# EasyEDA Pro project ProDoc_v03_02_PROTOCOL_ANALYZER_DUINO_4Plane_2025-05-19.epro

# Board v03_02_PROTOCOL_ANALYZER_DUINO_4Plane
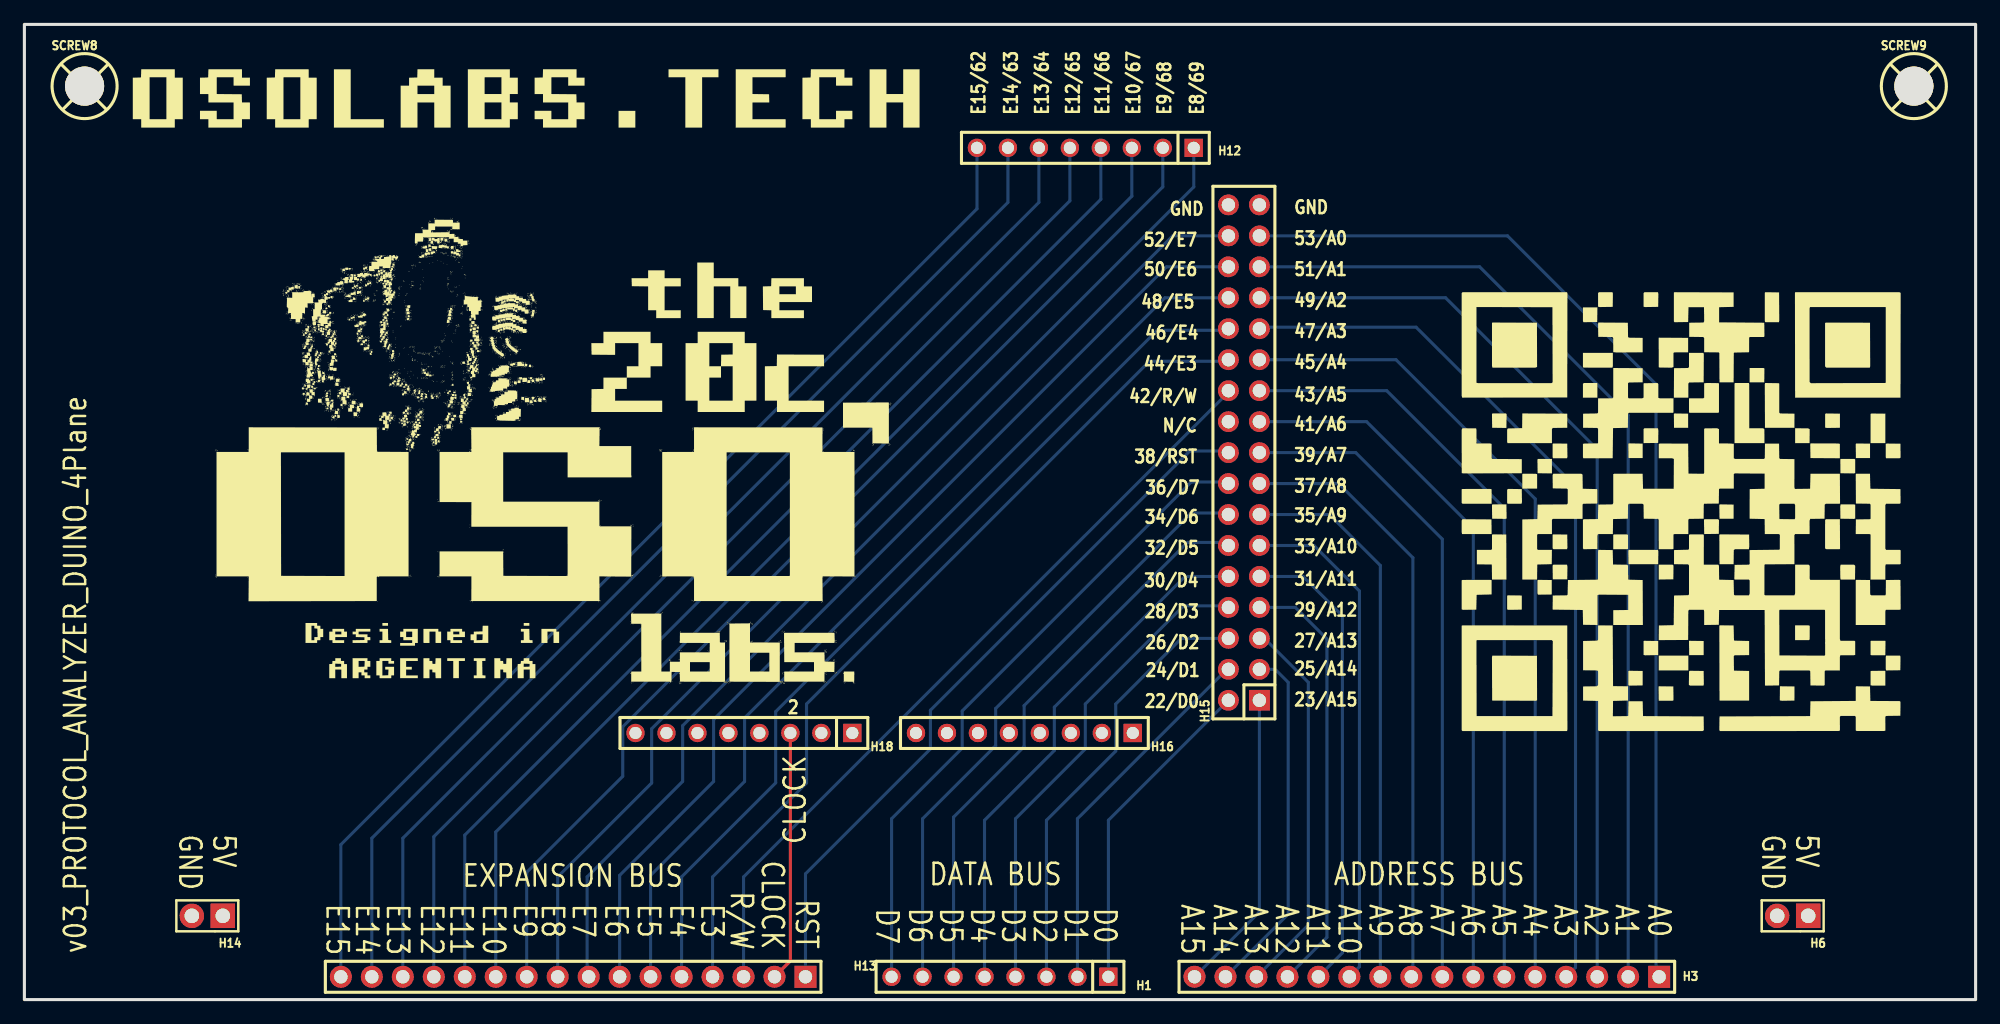
[diagram p0: board, top side]
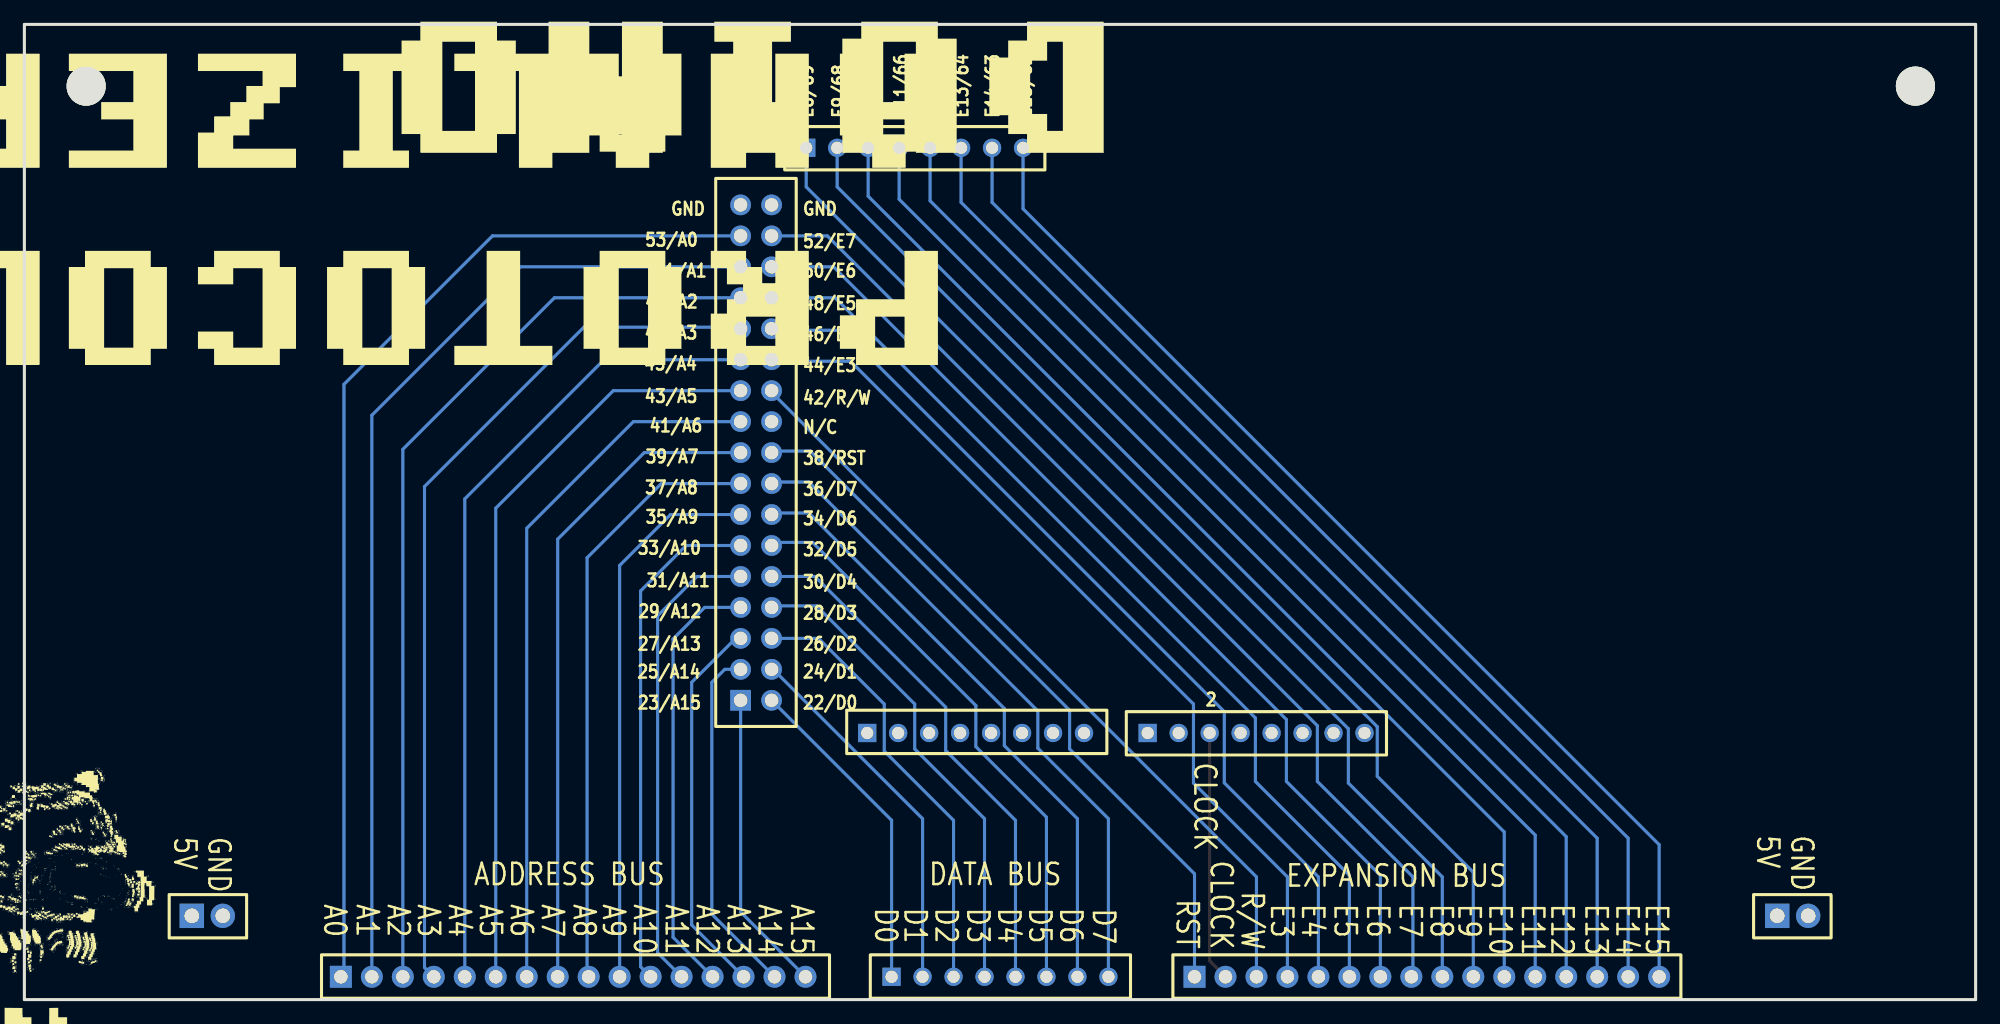
[diagram p1: board, bottom side, seen from below]

Outline 160 x 80 mm; copper layers: Top Layer, GROUND, 5V, Bottom Layer. Coordinates in mm from the lower left corner of the outline.
Outline path: rectangle 0,80 160,0
Stack: Top Layer 0.035mm 外层铜厚1oz / Dielectric1 0.2104mm 7628 RC49% 8.6mil / GROUND 0.0152mm 内层铜厚 / Dielectric2 1.065mm 1.1mm H/HOZ 含铜 / 5V 0.0152mm 内层铜厚 / Dielectric3 0.2104mm 7628 RC49% 8.6mil / Bottom Layer 0.035mm 外层铜厚1oz

## Design rules (mm)
template: Custom Config
spacing copperThickness1oz (default): track to track 0.102, other pairs 0.152 to 0.3
spacing copperThickness2oz: track to track 0.203, other pairs 0.152 to 0.3
track width copperThickness1oz (default): min 0.127, default 0.254, max 2.54
track width copperThickness2oz: min 0.203, default 0.254, max 2.54
differential pair differentialPair (default): width min 0.127, default 0.254, max 2.54; gap min 0.152, default 0.152
via viaSize (default): diameter min 0.5, default 0.61, max 10; hole min 0.3, default 0.305, max 6.299
net 5V uses 5VPlane

## Placement (name value [footprint] x y rotation side)
H1  X6511WV-08H-C60D30  [HDR-TH_8P-P2.54-V-M]  80 1.87 180 top
H3  X6511WV-16H-C60D30  [HDR-TH_16P-P2.54-V-M]  115 1.87 180 top
H6  X6511WV-02H-C60D30  [HDR-TH_2P-P2.54-V-M]  145 6.87 180 top
H12  X6511WV-08H-C60D30  [HDR-TH_8P-P2.54-V-M]  87 69.87 180 top
H13  X6511WV-16H-C60D30  [HDR-TH_16P-P2.54-V-M]  45 1.87 180 top
H14  X6511WV-02H-C60D30  [HDR-TH_2P-P2.54-V-M]  15 6.87 180 top
H15  PZ254-2-17-Z-8.5  [HDR-TH_34P-P2.54-V-M-R2-C17-S2.54]  100 44.87 90 top
H16  X6511WV-08H-C60D30  [HDR-TH_8P-P2.54-V-M]  82 21.87 180 top
H18  X6511WV-08H-C60D30  [HDR-TH_8P-P2.54-V-M]  59 21.87 180 top
SCREW8  -  [Screw-Hole-M3]  5 74.87 0 top
SCREW9  -  [Screw-Hole-M3]  155 74.87 0 top

## Footprints (pads in the part's own frame, mm; a bottom-side part is the same pattern mirrored in y, then rotated)
HDR-TH_2P-P2.54-V-M
  rect 2x2 hole 1.2: 1(-1.27,0)
  round 2 hole 1.2: 2(1.27,0)
HDR-TH_8P-P2.54-V-M
  rect 1.5x1.5 hole 1: 1(-8.89,0)
  round 1.5 hole 1: 2(-6.35,0) 3(-3.81,0) 4(-1.27,0) 5(1.27,0) 6(3.81,0) 7(6.35,0) 8(8.89,0)
HDR-TH_16P-P2.54-V-M
  rect 1.8x1.8 hole 1.1: 1(-19.05,0)
  round 1.8 hole 1.1: 2(-16.51,0) 3(-13.97,0) 4(-11.43,0) 5(-8.89,0) 6(-6.35,0) 7(-3.81,0) 8(-1.27,0) 9(1.27,0) 10(3.81,0) 11(6.35,0) 12(8.89,0) 13(11.43,0) 14(13.97,0) 15(16.51,0) 16(19.05,0)
HDR-TH_34P-P2.54-V-M-R2-C17-S2.54
  rect 1.7x1.7 hole 1.1: 1(-20.32,-1.27)
  round 1.7 hole 1.1: 2(-20.32,1.27) 3(-17.78,-1.27) 4(-17.78,1.27) 5(-15.24,-1.27) 6(-15.24,1.27) 7(-12.7,-1.27) 8(-12.7,1.27) 9(-10.16,-1.27) 10(-10.16,1.27) 11(-7.62,-1.27) 12(-7.62,1.27) 13(-5.08,-1.27) 14(-5.08,1.27) 15(-2.54,-1.27) 16(-2.54,1.27) 17(0,-1.27) 18(0,1.27) 19(2.54,-1.27) 20(2.54,1.27) 21(5.08,-1.27) 22(5.08,1.27) 23(7.62,-1.27) 24(7.62,1.27) 25(10.16,-1.27) 26(10.16,1.27) 27(12.7,-1.27) 28(12.7,1.27) 29(15.24,-1.27) 30(15.24,1.27) 31(17.78,-1.27) 32(17.78,1.27) 33(20.32,-1.27) 34(20.32,1.27)
Screw-Hole-M3
  round 3.2 hole 3.2: 1(-0.064,0.064)

## Nets
5V: H6.1 H14.1
A0: H3.1 H15.31
A1: H3.2 H15.29
A2: H3.3 H15.27
A3: H3.4 H15.25
A4: H3.5 H15.23
A5: H3.6 H15.21
A6: H3.7 H15.19
A7: H3.8 H15.17
A8: H3.9 H15.15
A9: H3.10 H15.13
A10: H3.11 H15.11
A11: H3.12 H15.9
A12: H3.13 H15.7
A13: H3.14 H15.5
A14: H3.15 H15.3
A15: H3.16 H15.1
CLOCK: H13.2 H18.3
D0: H1.1 H15.2
D1: H1.2 H15.4
D2: H1.3 H15.6
D3: H1.4 H15.8
D4: H1.5 H15.10
D5: H1.6 H15.12
D6: H1.7 H15.14
D7: H1.8 H15.16
E3: H13.4 H15.24
E4: H13.5 H15.26
E5: H13.6 H15.28
E6: H13.7 H15.30
E7: H13.8 H15.32
E8: H12.1 H13.9
E9: H12.2 H13.10
E10: H12.3 H13.11
E11: H12.4 H13.12
E12: H12.5 H13.13
E13: H12.6 H13.14
E14: H12.7 H13.15
E15: H12.8 H13.16
GROUND: H6.2 H14.2 H15.33 H15.34
R/W: H13.3 H15.22
RST: H13.1 H15.18

Pads without a net: H15 20; H16 1 2 3 4 5 6 7 8; H18 1 2 4 5 6 7 8; SCREW8 1; SCREW9 1

## Routing (per net, layer and track width the routed paths; a pad name or vN(x,y) marks a point on that pad's centre or on a via; arc(x,y) is an arc through that point)
A0: length 86.3
  Bottom Layer w0.254: H15.31 121.61,62.65 133.8,50.47 133.8,2.13 H3.1
A1: length 81.3
  Bottom Layer w0.254: H3.2 131.51,47.93 119.33,60.11 H15.29
A2: length 76.1
  Bottom Layer w0.254: H15.27 116.53,57.57 128.97,45.14 H3.3
A3: length 71.9
  Bottom Layer w0.254: H3.4 127.19,2.63 127.19,42.09 114.12,55.16 101.4,55.16 H15.25
A4: length 66.6
  Bottom Layer w0.254: H3.5 123.89,41.07 112.47,52.49 H15.23
A5: length 62.5
  Bottom Layer w0.254: H15.21 111.71,49.95 121.35,40.31 H3.6
A6: length 58
  Bottom Layer w0.254: H3.7 118.81,38.66 110.06,47.41 H15.19
A7: length 53.8
  Bottom Layer w0.254: H15.17 109.17,44.87 116.27,37.77 H3.8
A8: length 49.5
  Bottom Layer w0.254: H3.9 113.86,2 113.86,36.25 107.77,42.33 H15.15
A9: length 45.4
  Bottom Layer w0.254: H15.13 107.01,39.79 111.19,35.61 H3.10
A10: length 41.7
  Bottom Layer w0.254: H3.11 109.47,2.7 109.47,33.52 105.74,37.25 H15.11
A11: length 38.6
  Bottom Layer w0.254: H3.12 108.08,3.84 108.08,31.49 104.85,34.71 H15.9
A12: length 35.7
  Bottom Layer w0.254: H3.13 106.81,5.11 106.81,29.58 104.22,32.17 H15.7
A13: length 31.4
  Bottom Layer w0.254: H15.5 101.68,29.63 105.28,26.02 105.28,6.13 H3.14
A14: length 29.1
  Bottom Layer w0.254: H3.15 103.63,7.01 103.63,26.02 102.56,27.09 H15.3
A15: length 24.9
  Bottom Layer w0.254: H3.16 101.27,7.19 H15.1
CLOCK: length 20.5
  Top Layer w0.254: H18.3 62.81,3.17 H13.2
D0: length 26.8
  Bottom Layer w0.254: H1.1 88.89,14.71 H15.2
D1: length 30.5
  Bottom Layer w0.254: 98.73,27.22 86.35,14.84 H1.2
D2: length 36.2
  Bottom Layer w0.254: H15.6 94.87,29.63 89.49,24.25 89.49,20.39 83.81,14.71 H1.3
D3: length 39.8
  Bottom Layer w0.254: 98.73,32.3 95.05,32.3 87,24.25 87,20.56 81.27,14.84 H1.4
D4: length 43.2
  Bottom Layer w0.254: H1.5 78.73,14.71 84.45,20.44 ; 84.46,20.44 84.46,23.99 95.17,34.71 H15.10
D5: length 46.9
  Bottom Layer w0.254: 98.73,37.51 95.36,37.51 81.98,24.12 81.98,20.75 76.19,14.97 H1.6
D6: length 50.2
  Bottom Layer w0.254: H1.7 73.65,14.84 79.64,20.83 79.64,23.88 95.68,39.92 98.73,39.92
D7: length 53.8
  Bottom Layer w0.254: 98.73,42.46 95.68,42.46 76.9,23.68 76.9,20.63 71.11,14.84 H1.8
E3: length 71.8
  Bottom Layer w0.254: H13.4 56.43,10.06 64.13,17.77 64.13,24.25 92.25,52.36 98.73,52.36
E4: length 75
  Bottom Layer w0.254: H13.5 53.89,10.06 61.61,17.78 61.61,23.62 92.89,54.9 98.73,54.9
E5: length 78.4
  Bottom Layer w0.254: H13.6 51.35,10.19 59.06,17.9 59.06,23.1 93.52,57.57 H15.28
E6: length 81.9
  Bottom Layer w0.254: H15.30 93.65,60.11 56.52,22.98 56.52,17.9 48.81,10.19 H13.7
E7: length 85.3
  Bottom Layer w0.254: H15.32 94.16,62.65 53.97,22.47 53.97,17.9 46.14,10.07 46.14,2 H13.8
E8: length 89.6
  Bottom Layer w0.254: H12.1 95.89,66.67 51.44,22.21 51.44,17.77 43.73,10.06 H13.9
E9: length 89.6
  Bottom Layer w0.254: H12.2 93.35,66.67 49.06,22.38 49.06,18.32 41.19,10.45 H13.10
E10: length 89.6
  Bottom Layer w0.254: H12.3 90.81,65.91 38.65,13.75 H13.11
E11: length 89.6
  Bottom Layer w0.254: H13.12 36.11,13.49 88.27,65.65 H12.4
E12: length 89.6
  Bottom Layer w0.254: H12.5 85.73,65.53 33.57,13.37 H13.13
E13: length 89.6
  Bottom Layer w0.254: H12.6 83.19,65.4 31.03,13.24 H13.14
E14: length 89.6
  Bottom Layer w0.254: H13.15 28.49,13.24 80.65,65.4 H12.7
E15: length 89.6
  Bottom Layer w0.254: H12.8 78.11,64.87 25.95,12.71 H13.16
R/W: length 64.4
  Bottom Layer w0.254: 98.73,49.82 58.97,10.06 H13.3
RST: length 59.4
  Bottom Layer w0.254: H13.1 64.05,10.32 74.29,20.56 74.29,23.74 95.56,45 98.73,45

## Copper pours and planes (outline as drawn; the poured copper is in the pictures)
5V on 5V: 0.01,79.99 159.99,79.99 159.99,0.01 0.01,0.01
GROUND on GROUND: 0.26,79.74 159.74,79.74 159.74,0.26 0.26,0.26

Small or netless copper shapes (teardrops, artwork), in the pictures only: 14 on GROUND, 6 on 5V

## Text on the board
Bottom Silkscreen Layer: E15/62 | E14/63 | E13/64 | E12/65 | E11/66 | E10/67 | E9/68 | E8/69 | 2 | GND | 52/E7 | 50/E6 | 48/E5 | 46/E4 | 44/E3 | 42/R/W | N/C | 38/RST | 36/D7 | 34/D6 | 32/D5 | 30/D4 | 28/D3 | 26/D2 | 24/D1 | 22/D0 | 51/A1 | 41/A6 | 31/A11 | 39/A7 | 35/A9 | 53/A0 | 49/A2 | 37/A8 | 47/A3 | 43/A5 | 45/A4 | 29/A12 | 33/A10 | 27/A13 | 23/A15 | 25/A14 | 5V | E12 | E11 | E10 | E9 | E8 | E4 | E3 | R/W | CLOCK | RST | D7 | D6 | D5 | D4 | D3 | A15 | A14 | A13 | A12 | A11 | A7 | A6 | A5 | A4 | A3 | EXPANSION BUS | DATA BUS | ADDRESS BUS | E15 | E14 | E13 | E7 | E6 | E5 | D2 | D1 | D0 | A10 | A9 | A8 | A2 | A1 | A0
Top Silkscreen Layer: 2 | 42/R/W | 38/RST | 48/E5 | 44/E3 | 52/E7 | 50/E6 | 30/D4 | 34/D6 | 32/D5 | 28/D3 | 22/D0 | 46/E4 | 36/D7 | 26/D2 | 24/D1 | N/C | GND | 53/A0 | 51/A1 | 49/A2 | 47/A3 | 45/A4 | 43/A5 | 41/A6 | 39/A7 | 37/A8 | 35/A9 | 33/A10 | 31/A11 | 29/A12 | 27/A13 | 25/A14 | 23/A15 | E15/62 | E14/63 | E13/64 | E12/65 | E11/66 | E10/67 | E9/68 | E8/69 | v03_PROTOCOL_ANALYZER_DUINO_4Plane | E15 | E14 | E13 | E7 | E6 | E5 | D2 | D1 | D0 | A10 | A9 | A8 | A2 | A1 | A0 | EXPANSION BUS | DATA BUS | ADDRESS BUS | 5V | E12 | E11 | E10 | E9 | E8 | E4 | E3 | R/W | CLOCK | RST | D7 | D6 | D5 | D4 | D3 | A15 | A14 | A13 | A12 | A11 | A7 | A6 | A5 | A4 | A3
